# Altium schematic sheet DAC.SchDoc
size A4
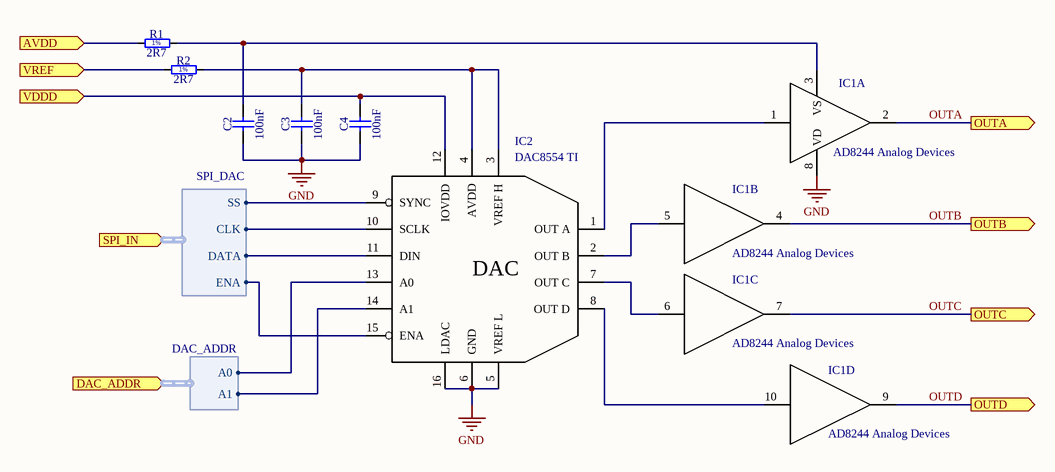
[diagram p0: DAC.SchDoc]

## Parts
C2  100nF  [CAPC2012X135N]
C3  100nF  [CAPC2012X135N]
C4  100nF  [CAPC2012X135N]
IC1  AD8244 Analog Devices  [TSSOP50P490X110-10N]  (parts A,B,C,D of 4)
IC2  DAC8554 TI  [TSOP65P640X120-16N]
R1  2R7  [RESC2012X60N]
R2  2R7  [RESC2012X60N]

## Ports
AVDD (in), DAC_ADDR (in, harness DAC_ADDR), OUTA (out), OUTB (out), OUTC (out), OUTD (out), SPI_IN (in, harness SPI_DAC), VDDD (in), VREF (in)

## Harnesses
SPI_DAC: DATA, CLK, SS, ENA
DAC_ADDR: A0, A1

## Nets
GND: C2.1 C3.1 C4.1 IC1.8(VD) IC2.5(VREF_L) IC2.6(GND) IC2.16(LDAC)
AVDD: R1.1 ; port AVDD
OUTA: IC1.2(OUT_A) ; port OUTA
OUTB: IC1.4(OUT_B) ; port OUTB
OUTC: IC1.7(OUT_C) ; port OUTC
OUTD: IC1.9(OUT_D) ; port OUTD
VDDD: C4.2 IC2.12(IOVDD) ; port VDDD
VREF: R2.1 ; port VREF
NetC2_2: C2.2 IC1.3(VS) R1.2
NetC3_2: C3.2 IC2.3(VREF_H) IC2.4(AVDD) R2.2
NetIC1_1: IC1.1(IN_A) IC2.1(OUT_A)
NetIC1_5: IC1.5(IN_B) IC2.2(OUT_B)
NetIC1_6: IC1.6(IN_C) IC2.7(OUT_C)
NetIC1_10: IC1.10(IN_D) IC2.8(OUT_D)
NetIC2_9: IC2.9(SYNC) ; port SPI_IN.SS
NetIC2_10: IC2.10(SCLK) ; port SPI_IN.CLK
NetIC2_11: IC2.11(DIN) ; port SPI_IN.DATA
NetIC2_13: IC2.13(A0) ; port DAC_ADDR.A0
NetIC2_14: IC2.14(A1) ; port DAC_ADDR.A1
NetIC2_15: IC2.15(ENA) ; port SPI_IN.ENA

## Notes on the sheet
- (in symbol DAC8554) DAC
- (in symbol R0805_2R7_1%_0.125W_200PPM) 1%

## Library data of the parts
C2-C4 = CC0805_100NF_50V_10%_X7R: Non-polarised capacitor; Part Description: SMD Multilayer Chip Ceramic Capacitor; Manufacturer: GENERIC; Manufacturer1 Part Number: C2012X7R1H104K085AA; Voltage: 50V; TC: X7R; Tolerance: ±10%; Part Number: CC0805_100NF_50V_10%_X7R; Component Kind: Standard; Component Type: Standard; Pin Count: 2; Value: 100nF; Status: Preferred; Manufacturer Part Number: CC0805_100NF_50V_10%_X7R; Case: 0805; Mounted: Yes; Socket: No; SMD: Yes; Sense: No; Manufacturer1 Example: TDK; Manufacturer1 ComponentHeight: 1mm; HelpURL: \\cern.ch\dfs\Applications\Altium\Datasheets\CC0805_X7R_TDK_C.pdf; Author: CERN DEM JLC; CreateDate: 03.12.2007; LatestRevisionDate: 22.04.2015
IC1 = AD8244: Name: AD8244; Manufacturer: Analog Devices
IC2 = DAC8554: Name: DAC8554; Manufacturer: TI
R1 R2 = R0805_2R7_1%_0.125W_200PPM: Resistor - 1%; Part Description: General Purpose Thick Film Chip Resistor; Manufacturer: GENERIC; Manufacturer1 Part Number: 232273462708L or RC0805FR-072R7L; Power: 0.125W; TC: ±200ppm/°C; PressFit: No; Part Number: R0805_2R7_1%_0.125W_200PPM; Component Kind: Standard; Component Type: Standard; Pin Count: 2; Value: 2R7; Status: Preferred; Tolerance: ±1%; Manufacturer Part Number: R0805_2R7_1%_0.125W_200PPM; Case: 0805; Mounted: Yes; Sense: No; Socket: No; SMD: Yes; Manufacturer1 Example: YAGEO PHYCOMP; Manufacturer1 ComponentHeight: 0.65mm; HelpURL: \\cern.ch\dfs\Applications\Altium\Datasheets\R0805_Phycomp_RC0805.pdf; Author: CERN DEM JLC; CreateDate: 03.12.2007; LatestRevisionDate: 17.10.2012